# EAGLE design chumbilight-1.0 (EAGLE 5.06)
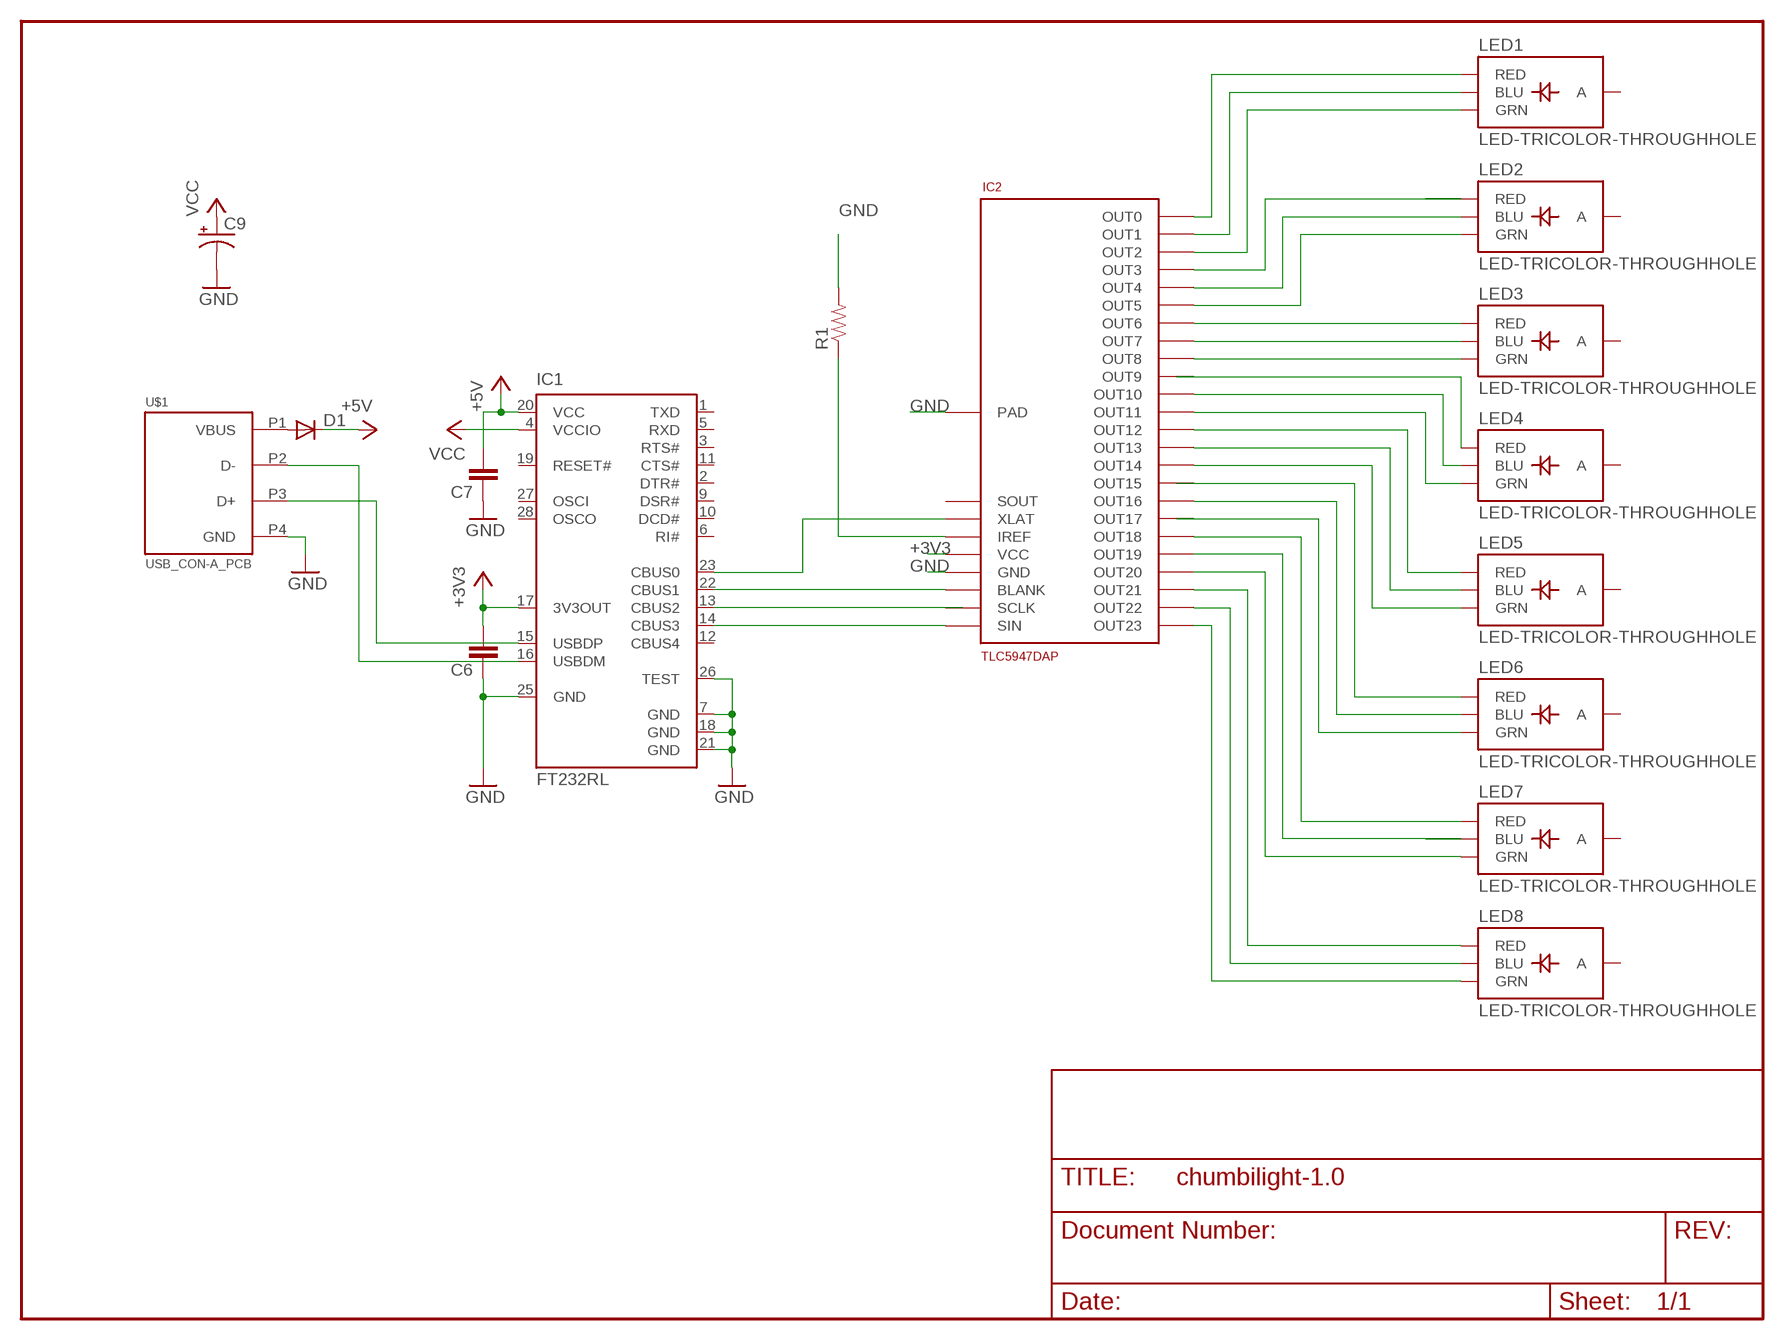
[diagram p0: schematic, sheet 1]

## Parts
C6  C-EUC0603K  [C0603K]
C7  C-EUC0603K  [C0603K]
C9  CPOL-USA/3216-18R  [A/3216-18R]
D1  DIODE-SOD123  [SOD123]
IC1  FT232RL  [SSOP28]
IC2  TLC5947DAP  [HTSSOP32DAP]
LED1  LED-TRICOLOR-THROUGHHOLE  [LED-TRICOLOR-THROUGHHOLE]
LED2  LED-TRICOLOR-THROUGHHOLE  [LED-TRICOLOR-THROUGHHOLE]
LED3  LED-TRICOLOR-THROUGHHOLE  [LED-TRICOLOR-THROUGHHOLE]
LED4  LED-TRICOLOR-THROUGHHOLE  [LED-TRICOLOR-THROUGHHOLE]
LED5  LED-TRICOLOR-THROUGHHOLE  [LED-TRICOLOR-THROUGHHOLE]
LED6  LED-TRICOLOR-THROUGHHOLE  [LED-TRICOLOR-THROUGHHOLE]
LED7  LED-TRICOLOR-THROUGHHOLE  [LED-TRICOLOR-THROUGHHOLE]
LED8  LED-TRICOLOR-THROUGHHOLE  [LED-TRICOLOR-THROUGHHOLE]
R1  RESISTORPTH1  [AXIAL-0.3]
U$1  USB_CON-A_PCB  [USBA_PCB]

## Nets
+3V3 [PWR]: C6.2 IC1.17(3V3OUT) IC2.32(VCC)
+5V [PWR]: C7.2 D1.C IC1.20(VCC)
GND [PWR]: C6.1 C7.1 C9.- IC1.7(GND) IC1.18(GND) IC1.21(GND) IC1.25(GND) IC1.26(TEST) IC2.1(GND) IC2.EXP(PAD) R1.P$2 U$1.P4(GND)
N$1: IC1.14(CBUS3) IC2.4(SIN)
N$2: IC1.13(CBUS2) IC2.3(SCLK)
N$3: IC1.22(CBUS1) IC2.2(BLANK)
N$4: IC1.23(CBUS0) IC2.30(XLAT)
N$5: IC1.15(USBDP) U$1.P3(D+)
N$6: IC2.31(IREF) R1.P$1
N$7: IC2.5(OUT0) LED1.RED
N$8: IC2.6(OUT1) LED1.BLU
N$9: IC1.16(USBDM) U$1.P2(D-)
N$10 [PWR]: D1.A U$1.P1(VBUS)
N$11: IC2.7(OUT2) LED1.GRN
N$12: IC2.8(OUT3) LED2.RED
N$13: IC2.9(OUT4) LED2.BLU
N$14: IC2.10(OUT5) LED2.GRN
N$15: IC2.11(OUT6) LED3.RED
N$16: IC2.12(OUT7) LED3.BLU
N$17: IC2.13(OUT8) LED3.GRN
N$18: IC2.14(OUT9) LED4.RED
N$19: IC2.15(OUT10) LED4.BLU
N$20: IC2.16(OUT11) LED4.GRN
N$21: IC2.17(OUT12) LED5.RED
N$22: IC2.18(OUT13) LED5.BLU
N$23: IC2.19(OUT14) LED5.GRN
N$24: IC2.20(OUT15) LED6.RED
N$25: IC2.21(OUT16) LED6.BLU
N$26: IC2.22(OUT17) LED6.GRN
N$27: IC2.23(OUT18) LED7.RED
N$28: IC2.24(OUT19) LED7.BLU
N$29: IC2.25(OUT20) LED7.GRN
N$30: IC2.26(OUT21) LED8.RED
N$31: IC2.27(OUT22) LED8.BLU
N$32: IC2.28(OUT23) LED8.GRN
VCC [PWR]: C9.+ IC1.4(VCCIO)
Unconnected: IC1.1(TXD) IC1.2(DTR#) IC1.3(RTS#) IC1.5(RXD) IC1.6(RI#) IC1.9(DSR#) IC1.10(DCD#) IC1.11(CTS#) IC1.12(CBUS4) IC1.19(RESET#) IC1.27(OSCI) IC1.28(OSCO) IC2.29(SOUT) LED1.GND(A) LED2.GND(A) LED3.GND(A) LED4.GND(A) LED5.GND(A) LED6.GND(A) LED7.GND(A) LED8.GND(A)

## Library data of the parts
C6 C7 = rcl:C-EU: CAPACITOR, European symbol
C9 = rcl-2:CPOL-US: POLARIZED CAPACITOR, American symbol
D1 = diode:DIODE-: DIODE
IC1 = ftdichip:FT232R: Source: http://www.ftdichip.com/Documents/DataSheets/DS_FT232R_v104.pdf
IC2 = TLC5947:TLC5947
LED1-LED8 = SparkFun:LED-TRICOLOR-THROUGHHOLE
R1 = SparkFun:RESISTOR: Resistor Basic schematic elements and footprints for 0603, 1206, and PTH 1/10th watt (small) resistors.
U$1 = spiffie-org:USB_CON

## Net classes
1 PWR: width 0.254 mm, drill 0.61 mm

## Board
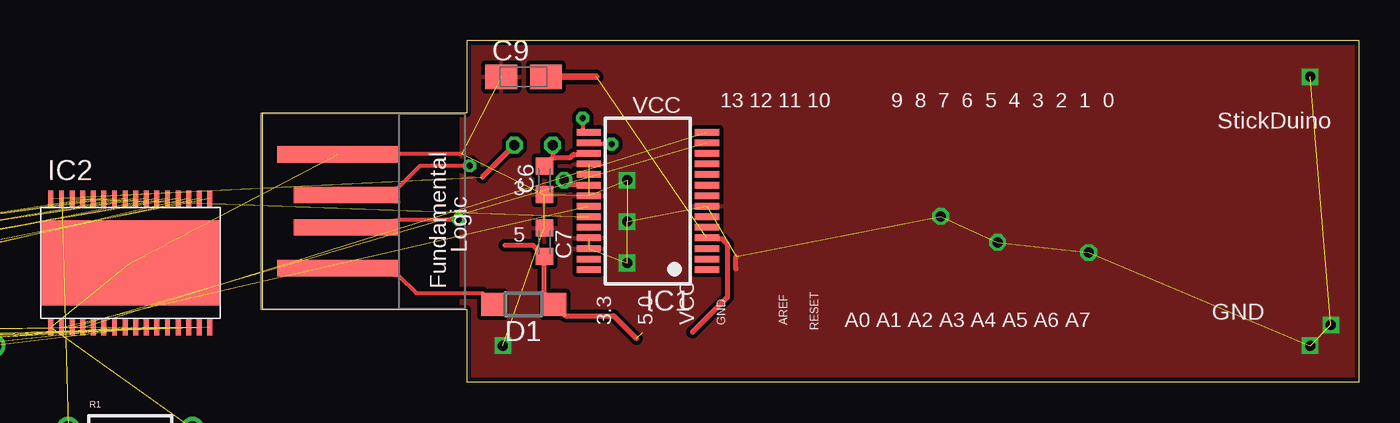
[diagram p1: board, top side]
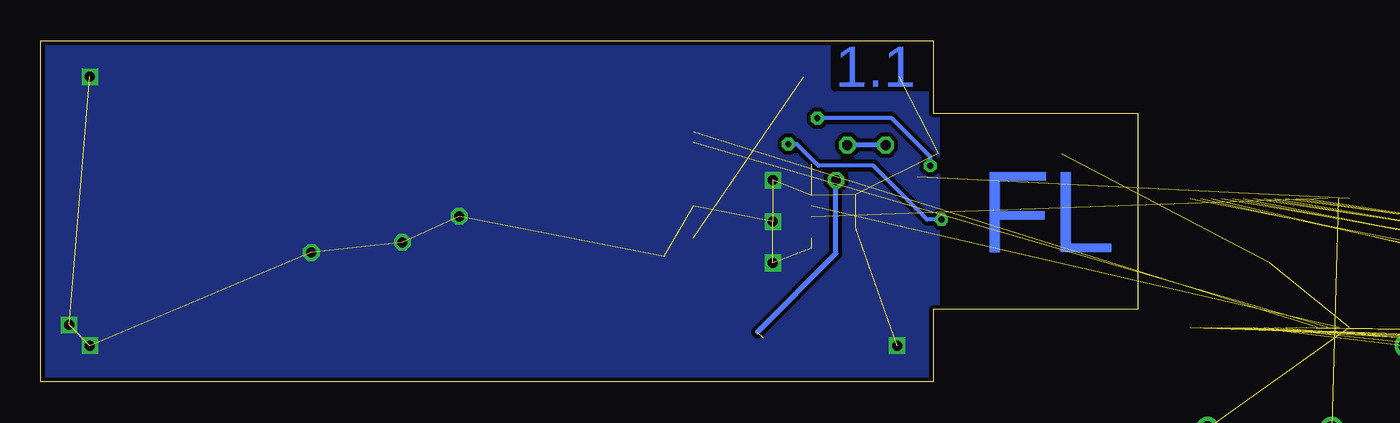
[diagram p2: board, bottom side, seen from below]

Size 67.3 x 20.96 mm. Coordinates in mm from the lower left corner, seen from the top.
Outline: 0,4.45 12.54,4.45 12.54,0 67.3,0.01 67.3,20.95 12.54,20.96 12.54,16.51 0,16.51 0,4.45
Copper layers (1*16): Top 0.035mm / dielectric 1.5mm / Bottom 0.035mm
Design rules "default": minimum track width 10mil, minimum drill 15mil, track to track 8mil, track to pad 8mil, pad to pad 8mil, via to via 8mil, smd to smd 8mil, copper to edge 10mil, drill to drill 8mil, minimum pad ring 10mil, minimum via ring 8mil, stop-mask expansion 4mil, vias tented up to drill 0mil, thermal gap 10mil

### Footprints (pad centres in the part's own frame; a part is rotated, then mirrored left to right if it is on the bottom)
C0603K = smd 1.05 x 1.08: 1 -0.875,0; 2 0.875,0
A/3216-18R = smd 1.95 x 1.5: + 1.375,0; - -1.375,0
SOD123 = smd 1.4 x 1.4: A 1.9,0; C -1.9,0
SSOP28 = smd 0.4 x 1.5: 1 -4.225,-3.625; 2 -3.575,-3.625; 3 -2.925,-3.625; 4 -2.275,-3.625; 5 -1.625,-3.625; 6 -0.975,-3.625; 7 -0.325,-3.625; 8 0.325,-3.625; 9 0.975,-3.625; 10 1.625,-3.625; 11 2.275,-3.625; 12 2.925,-3.625; 13 3.575,-3.625; 14 4.225,-3.625; 15 4.225,3.625; 16 3.575,3.625; 17 2.925,3.625; 18 2.275,3.625; 19 1.625,3.625; 20 0.975,3.625; 21 0.325,3.625; 22 -0.325,3.625; 23 -0.975,3.625; 24 -1.625,3.625; 25 -2.275,3.625; 26 -2.925,3.625; 27 -3.575,3.625; 28 -4.225,3.625
HTSSOP32DAP = smd 0.3 x 1: 1 -4.875,-3.95; 2 -4.225,-3.95; 3 -3.575,-3.95; 4 -2.925,-3.95; 5 -2.275,-3.95; 6 -1.625,-3.95; 7 -0.975,-3.95; 8 -0.325,-3.95; 9 0.325,-3.95; 10 0.975,-3.95; 11 1.625,-3.95; 12 2.275,-3.95; 13 2.925,-3.95; 14 3.575,-3.95; 15 4.225,-3.95; 16 4.875,-3.95; 17 4.875,3.95; 18 4.225,3.95; 19 3.575,3.95; 20 2.925,3.95; 21 2.275,3.95; 22 1.625,3.95; 23 0.975,3.95; 24 0.325,3.95; 25 -0.325,3.95; 26 -0.975,3.95; 27 -1.625,3.95; 28 -2.275,3.95; 29 -2.925,3.95; 30 -3.575,3.95; 31 -4.225,3.95; 32 -4.875,3.95 | smd 11 x 5.2: EXP 0,0
LED-TRICOLOR-THROUGHHOLE = drill 1 round: BLU 1,0; GND -1,0; GRN 3,0; RED -3,0
AXIAL-0.3 = drill 0.9 round: P$1 -3.81,0; P$2 3.81,0
USBA_PCB = smd 7.5 x 1: P1 -3.75,-3.5; P4 -3.75,3.5 | smd 6.5 x 1: P2 -3.25,-1; P3 -3.25,1

### Placement (x,y rotation side)
C6  17.3,12.38 90 top
C7  17.3,8.57 270 top
C9  16.03,18.73 0 top
D1  16.03,4.76 180 top
IC1  23.65,11.11 90 top
IC2  -8.1,7.3 0 top  (outside the outline)
LED1  -81.76,2.22 0 top  (outside the outline)
LED2  -19.53,2.22 0 top  (outside the outline)
LED3  -28.42,2.22 0 top  (outside the outline)
LED4  -37.31,2.22 0 top  (outside the outline)
LED5  -46.2,2.22 0 top  (outside the outline)
LED6  -55.09,2.22 0 top  (outside the outline)
LED7  -63.98,2.22 0 top  (outside the outline)
LED8  -72.87,2.22 0 top  (outside the outline)
R1  -8.1,-2.86 0 top  (outside the outline)
U$1  8.41,10.48 0 top

### Tracks (layer width: path | path; a pad name or v marks a point on that pad's centre or on a via)
+3V3  (via drill 0.61)  (1 unrouted)
  Top 0.305: 17.81,13.78 18.88,13.78 19.08,13.97 19.33,13.97 IC1.17 | 17.81,13.78 C6.2 | 13.49,12.57 v15.46,14.54 | v17.81,14.54 17.81,13.78
  Bottom 0.305: v15.46,14.54 v17.81,14.54
+5V  (via drill 0.61)  (1 unrouted)
  Top 0.305: 14.88,8.38 16.6,8.38 16.79,8.19 C7.2 17.3,5.46 D1.C 18.57,4.06 21.55,4.06 22.95,2.67 | v18.5,12.38 18.76,12.13 19.33,12.13 IC1.20
  Bottom 0.305: v18.5,12.38 18.5,7.87 23.33,3.05
GND  (via drill 0.61)  (22 unrouted)
  Top 0.254: U$1.P4 8.34,14.03 12.22,14.03
  Top 0.305: 29.07,6.91 29.04,6.99 29.04,7.62 29.07,7.7
  other vias: 50.7,7.94 41.62,10.16 45.11,8.57 22.38,12.38 22.38,9.84 22.38,7.3 64.29,18.73 65.56,3.49 64.29,2.22 14.76,2.22
  pour Bottom (isolate 0.254): 12.22,21.27 68.1,21.27 68.1,-0.32 12.22,-0.32
  pour Top (isolate 0.254): 12.22,21.27 68.1,21.27 68.1,-0.32 12.22,-0.32
N$1  (1 unrouted)
N$2  (1 unrouted)
N$3  (1 unrouted)
N$4  (1 unrouted)
N$5  (via drill 0.38)
  Top 0.254: 8.34,11.05 U$1.P3 8.34,11.94 9.68,13.27 v12.73,13.27 | v19.65,16.19 19.65,15.49 IC1.15
  Bottom 0.254: v19.65,16.19 15.07,16.19 12.73,13.84 v12.73,13.27
N$6  (1 unrouted)
N$7  (1 unrouted)
N$8  (1 unrouted)
N$9  (via drill 0.38)
  Top 0.254: v21.42,14.6 20.73,14.6 IC1.16 | v12.03,9.97 8.34,9.97 U$1.P2
  Bottom 0.254: v21.42,14.6 20.92,14.6 19.58,13.27 16.22,13.27 12.92,9.97 v12.03,9.97
N$10
  Top 0.254: D1.A 13.49,5.46 9.42,5.46 8.34,6.54 U$1.P1
N$11  (1 unrouted)
N$12  (1 unrouted)
N$13  (1 unrouted)
N$14  (1 unrouted)
N$15  (1 unrouted)
N$16  (1 unrouted)
N$17  (1 unrouted)
N$18  (1 unrouted)
N$19  (1 unrouted)
N$20  (1 unrouted)
N$21  (1 unrouted)
N$22  (1 unrouted)
N$23  (1 unrouted)
N$24  (1 unrouted)
N$25  (1 unrouted)
N$26  (1 unrouted)
N$27  (1 unrouted)
N$28  (1 unrouted)
N$29  (1 unrouted)
N$30  (1 unrouted)
N$31  (1 unrouted)
N$32  (1 unrouted)
VCC  (1 unrouted)
  Top 0.305: 26.38,3.05 28.54,5.21 28.54,8.45 28.22,8.76 27.97,8.76 IC1.4
  Top 0.406: C9.+ 20.47,18.73

### Text on the board
Bottom: 1.1 | FL
tPlace: VCC | 13 12 11 10 | 9 8 7 6 5 4 3 2 1 0 | StickDuino | 3 | 5 | Logic | Fundamental | 3.3 | 5.0 | VCC | GND | AREF | A0 A1 A2 A3 A4 A5 A6 A7 | GND | RESET